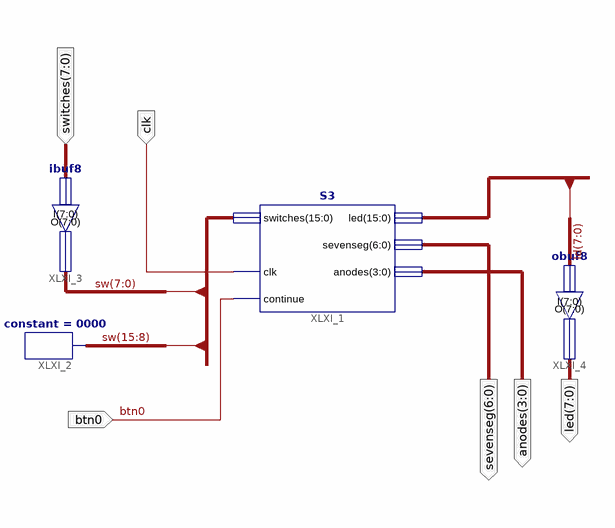
[diagram p0: schematic sheet 1]
// Xilinx ISE schematic toplevel.sch (spartan3e) as structural Verilog: 4 symbols, 6 ports
module toplevel (
  input  clk,
  input  [7:0] switches,
  input  btn0,
  output [6:0] sevenseg,
  output [3:0] anodes,
  output [7:0] led
);

  wire [15:0] ld, sw;

  constant #(.CValue("0000")) XLXI_2 (.O(sw[15:8]));
  ibuf8 XLXI_3 (.I(switches), .O(sw[7:0]));
  obuf8 XLXI_4 (.I(ld[7:0]), .O(led));
  S3 XLXI_1 (.switches(sw), .clk(clk), .\continue (btn0), .led(ld), .sevenseg(sevenseg), .anodes(anodes));
endmodule
